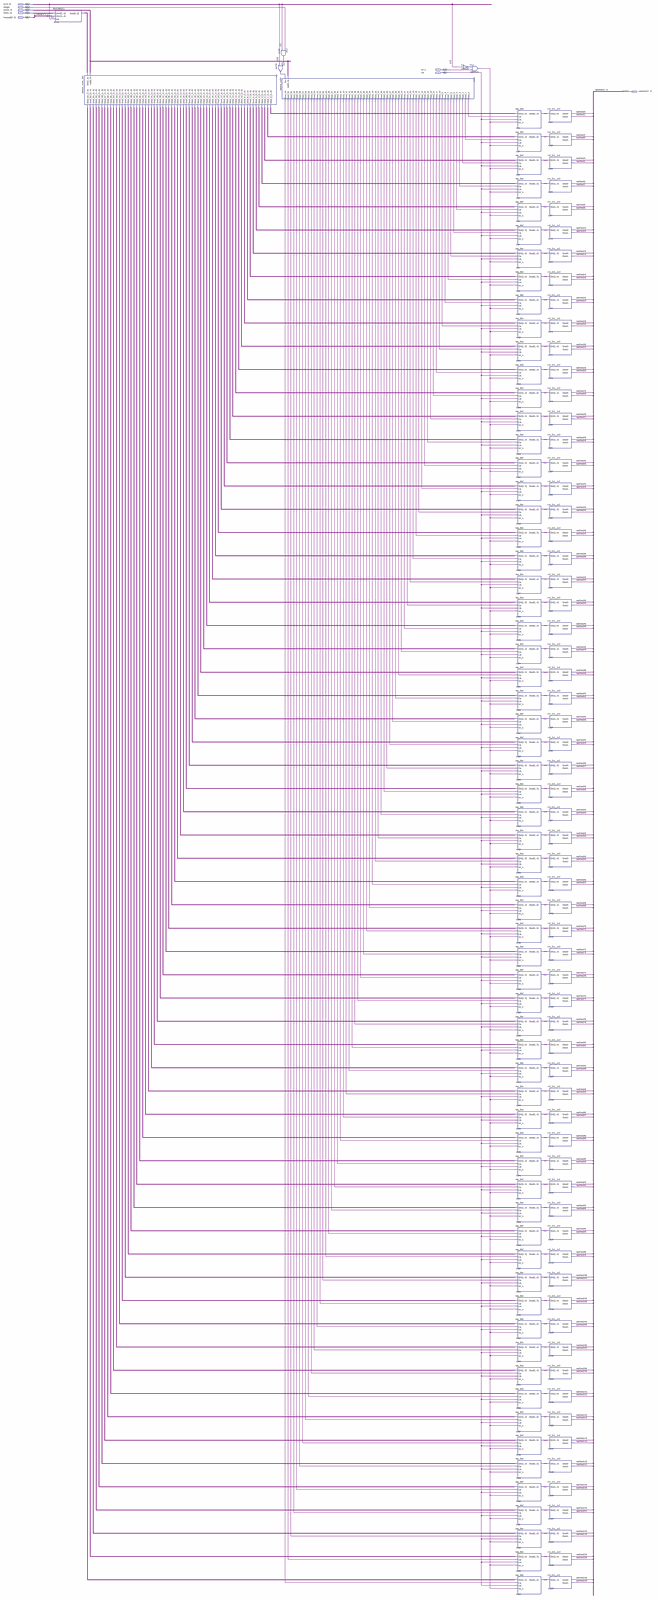
[diagram p0: schematic sheet, whole]
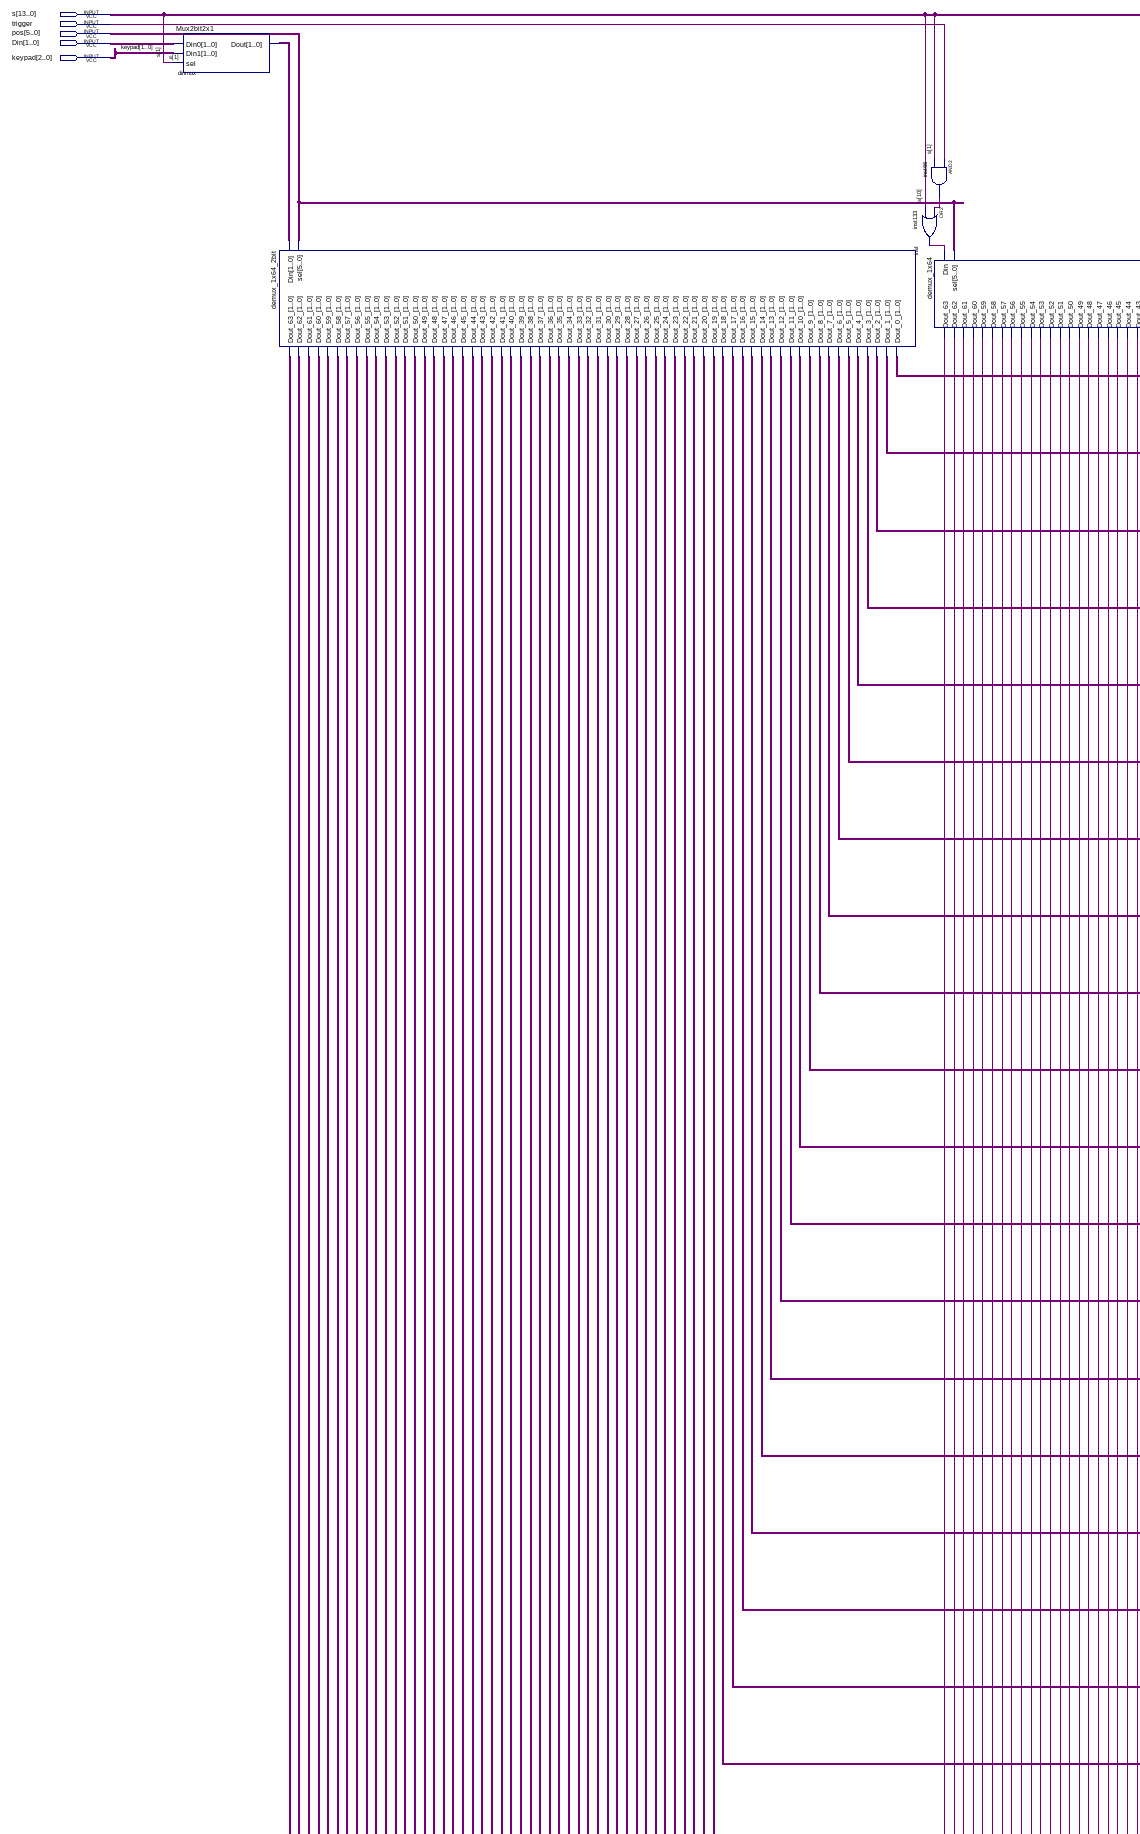
[diagram p1: schematic sheet, upper left part]
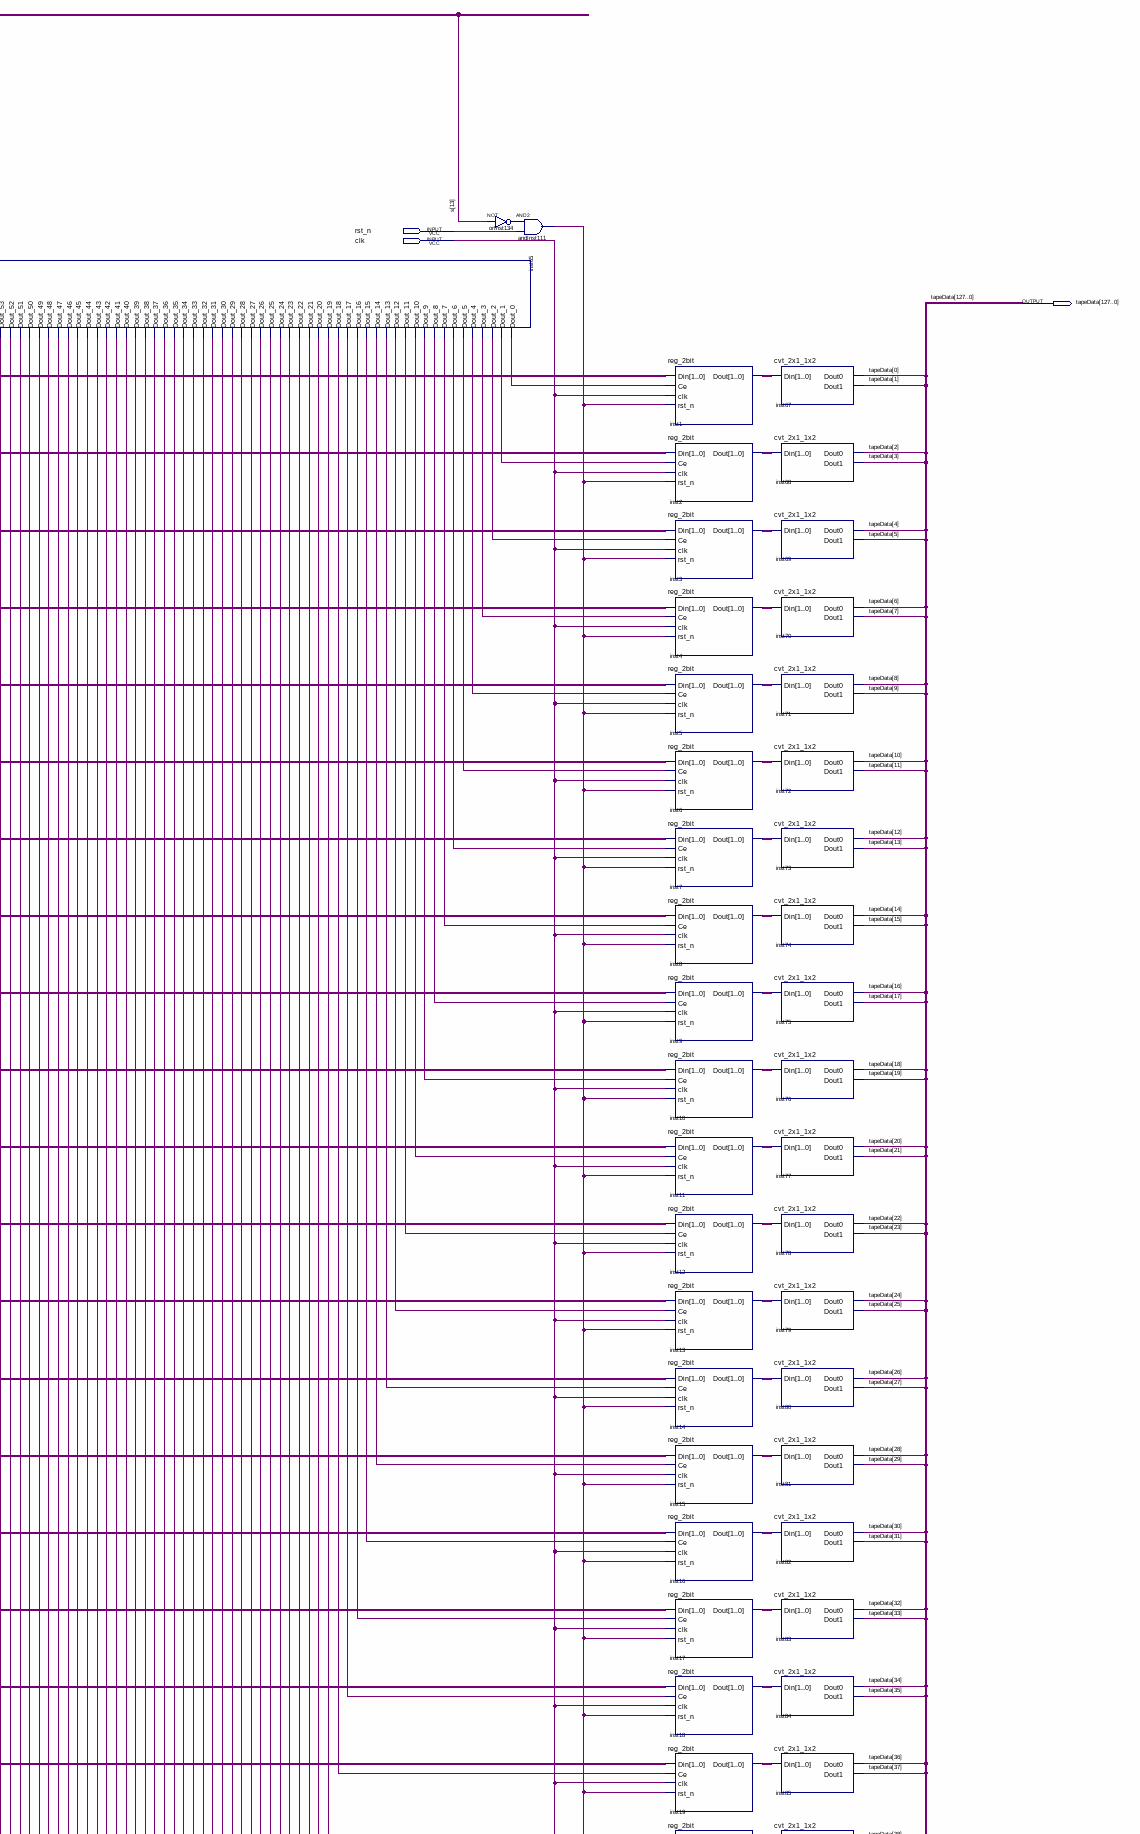
[diagram p2: schematic sheet, upper right part]
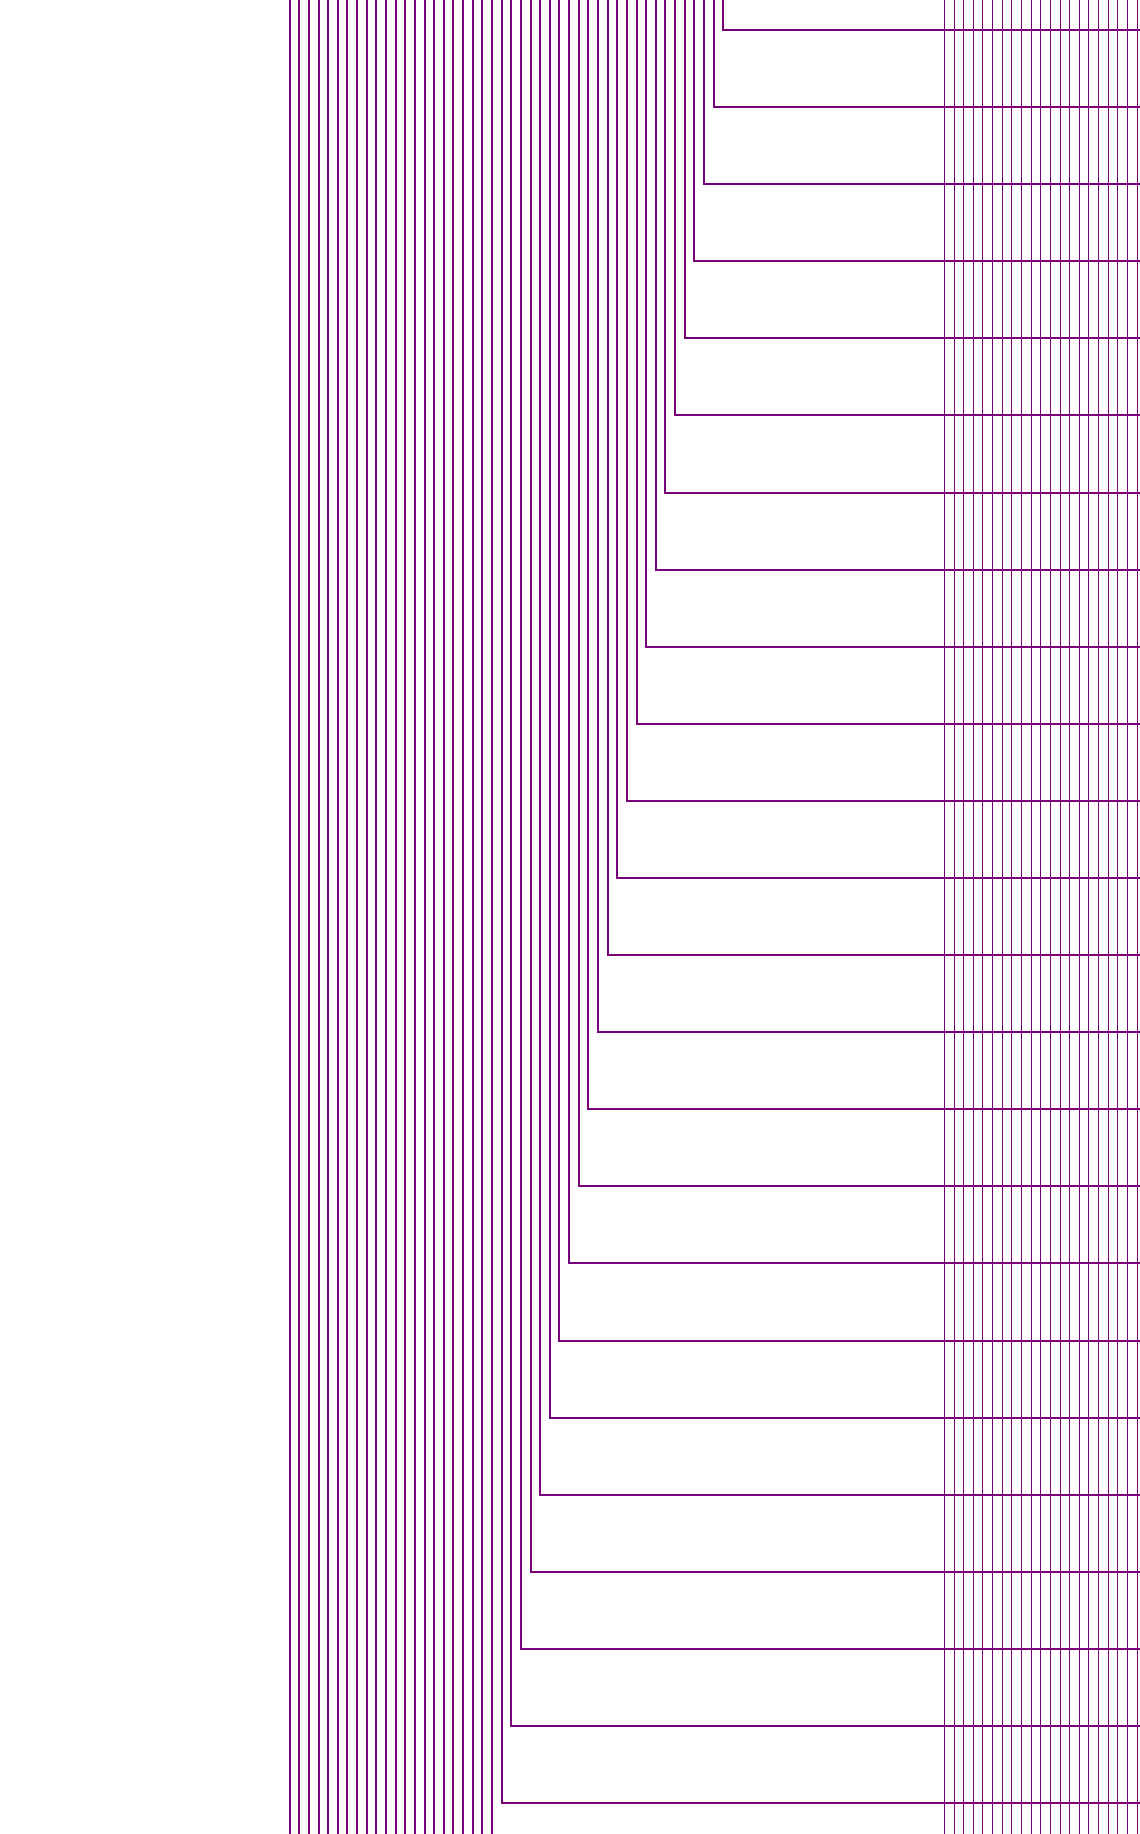
[diagram p3: schematic sheet, middle left part]
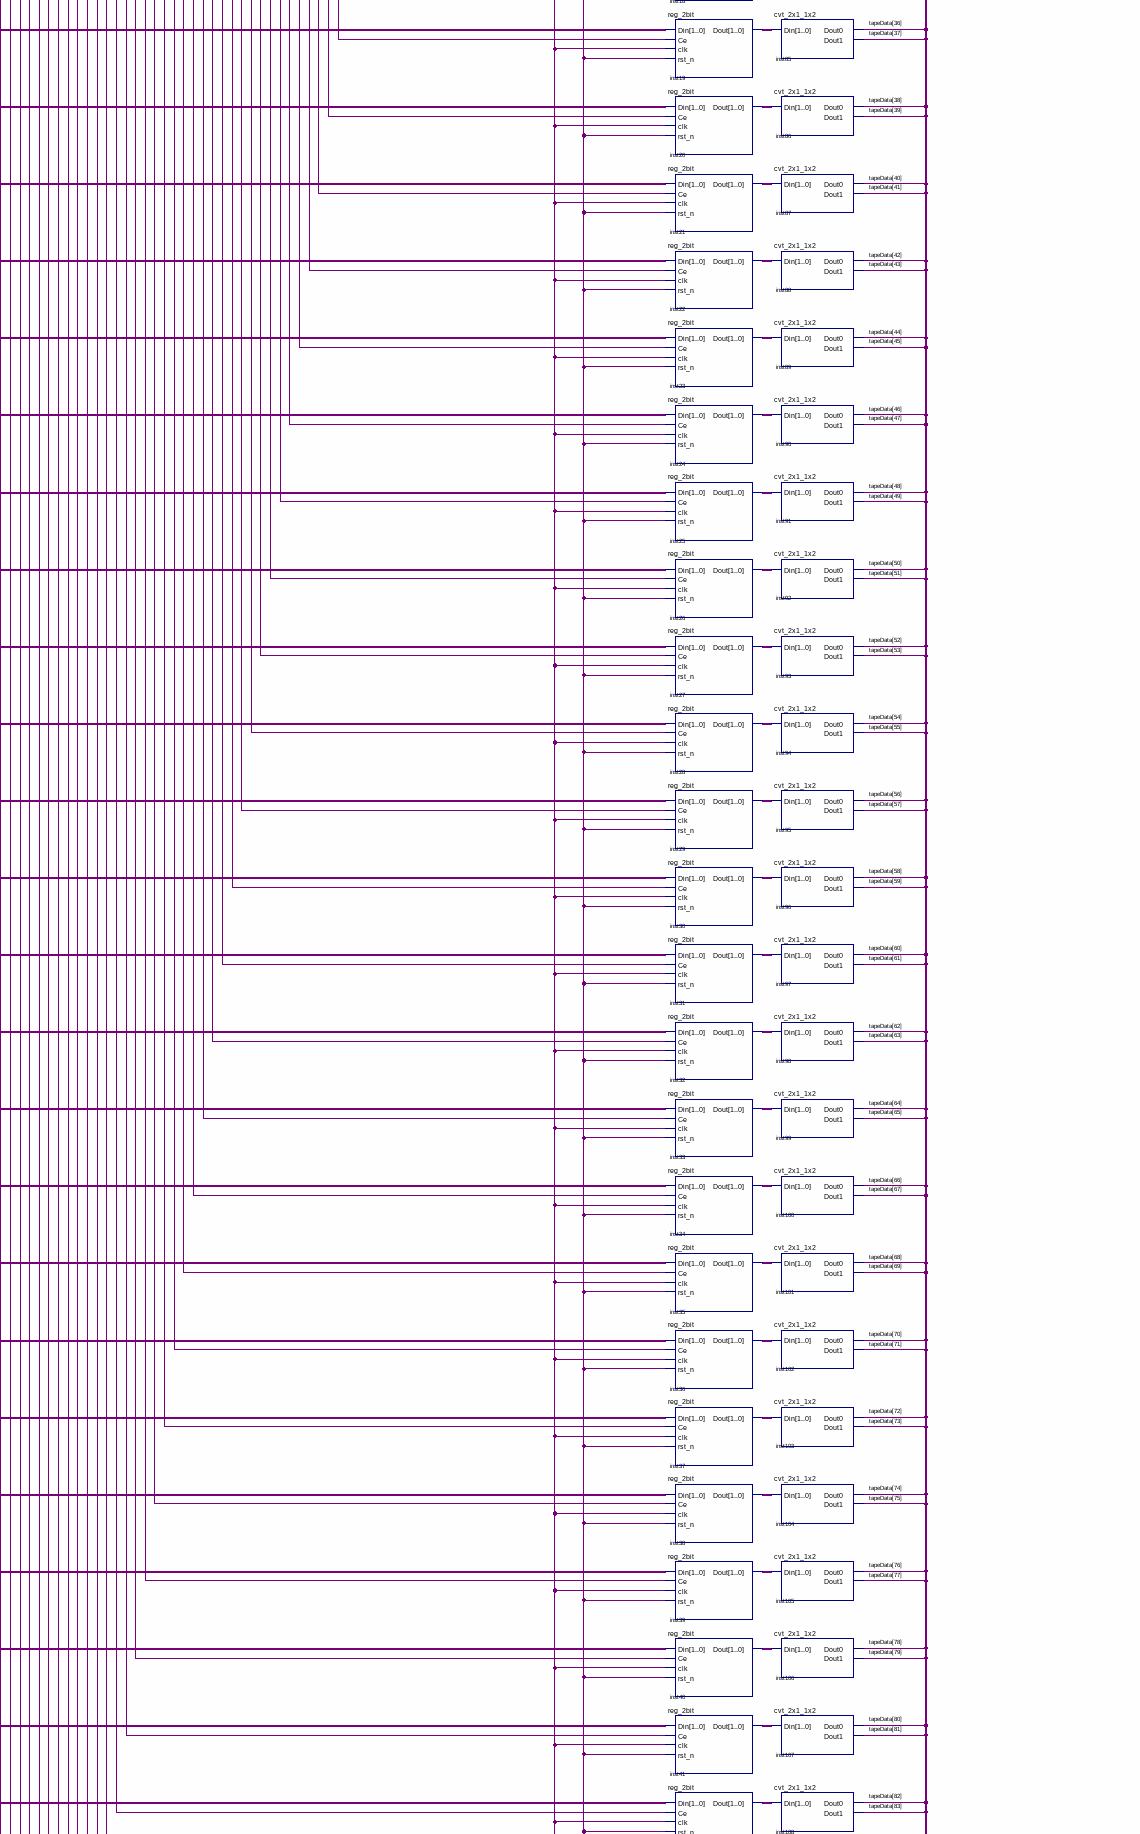
[diagram p4: schematic sheet, middle right part]
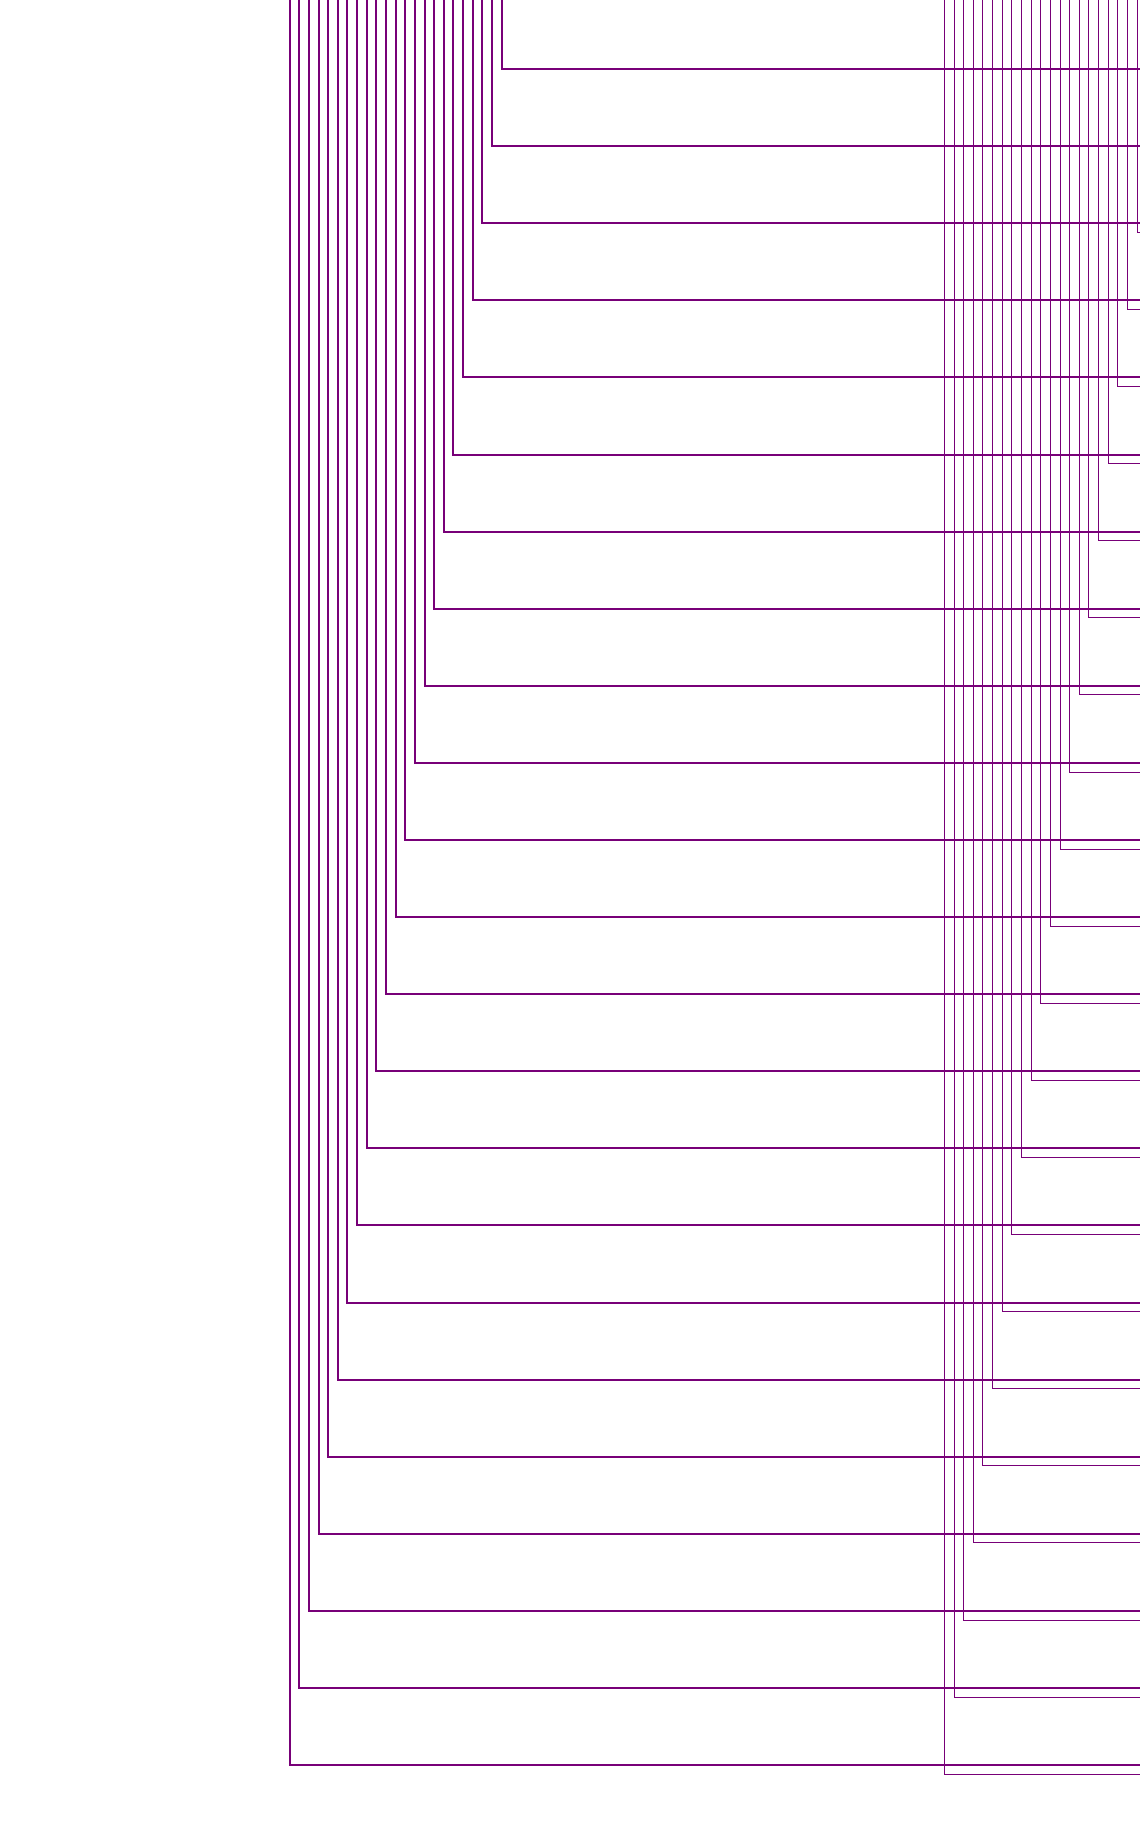
[diagram p5: schematic sheet, lower left part]
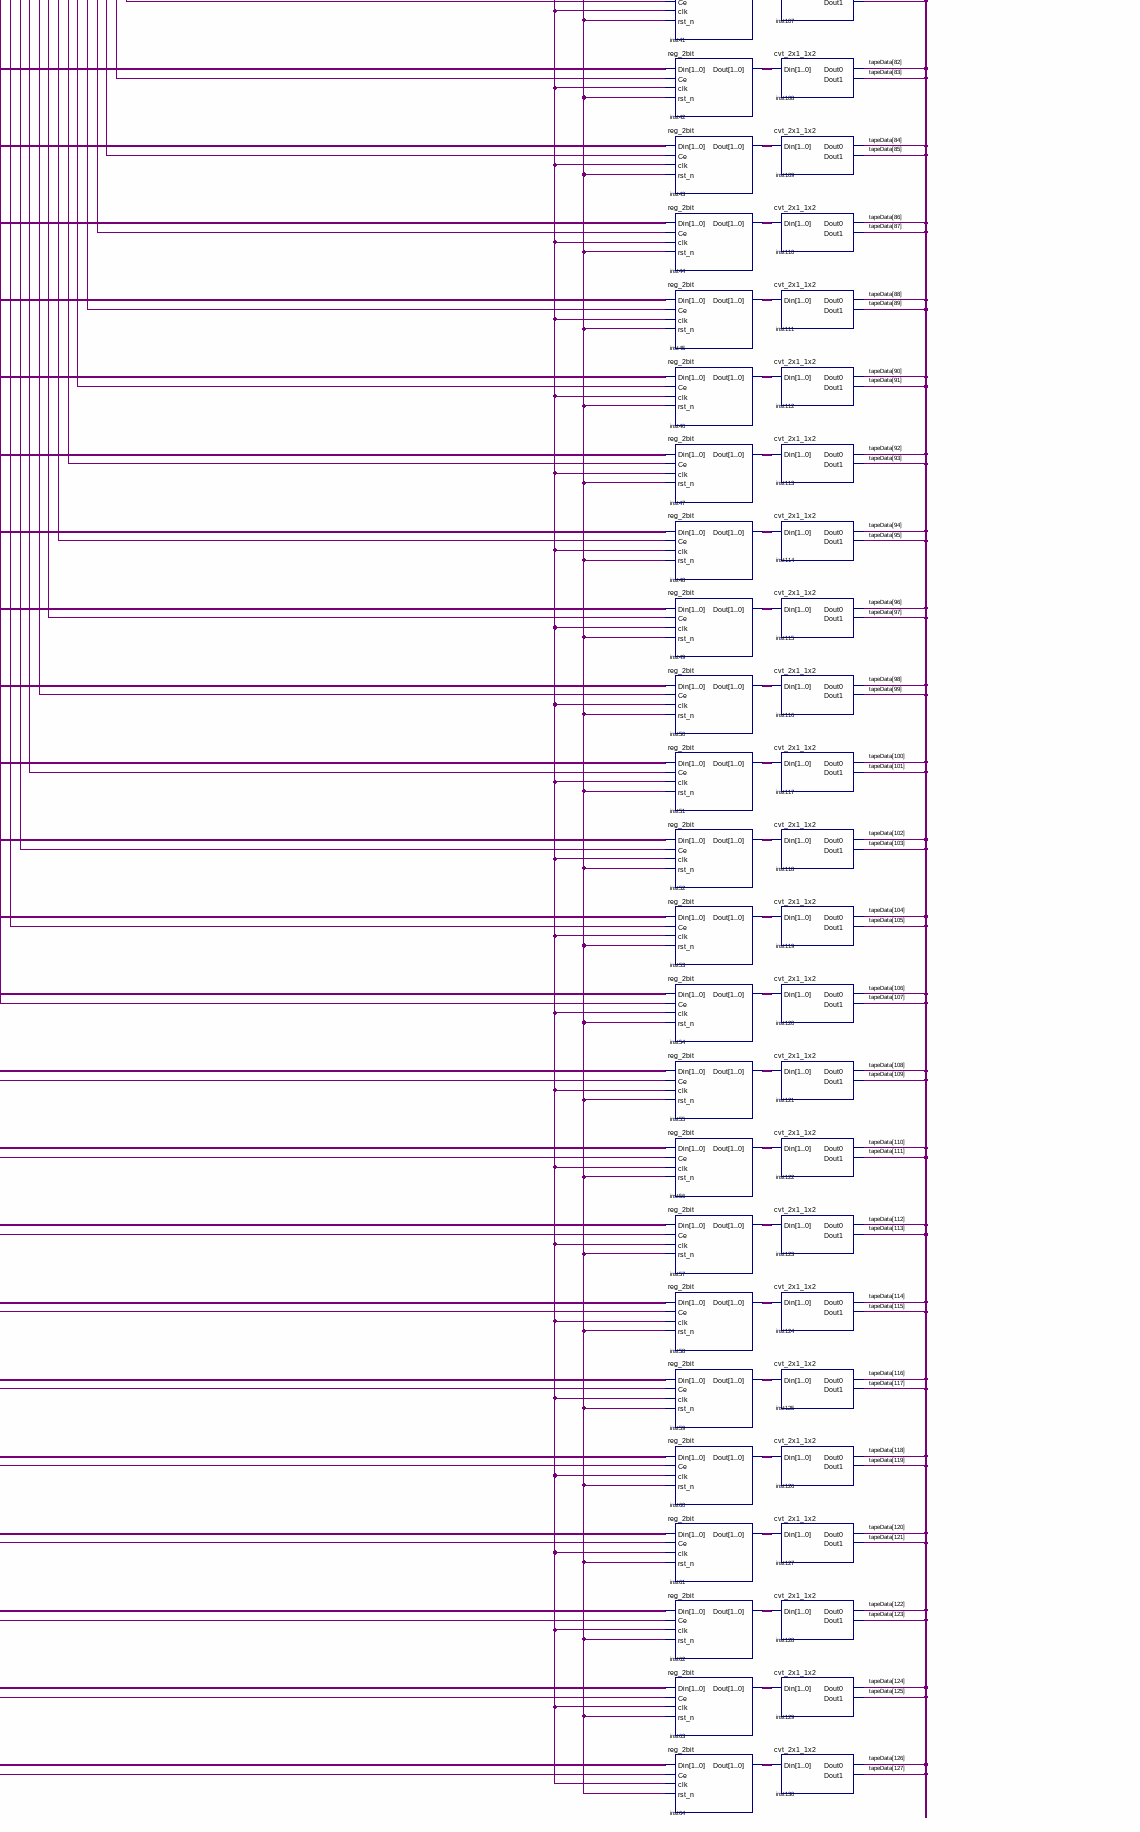
[diagram p6: schematic sheet, lower right part]
// Quartus schematic tape_64.bdf as structural Verilog: 135 symbols, 8 pins
module tape_64 (
  input  [13:0] s,
  input  trigger,
  input  [5:0] pos,
  input  [1:0] Din,
  input  [2:0] keypad,
  input  rst_n,
  input  clk,
  output [127:0] tapeData
);

  wire andInst111_out, inst65_dout_0, inst65_dout_1, inst65_dout_2, inst65_dout_3, inst65_dout_4,
       inst65_dout_5, inst65_dout_6, inst65_dout_7, inst65_dout_8, inst65_dout_9, inst65_dout_10,
       inst65_dout_11, inst65_dout_12, inst65_dout_13, inst65_dout_14, inst65_dout_15, inst65_dout_16,
       inst65_dout_17, inst65_dout_18, inst65_dout_19, inst65_dout_20, inst65_dout_21, inst65_dout_22,
       inst65_dout_23, inst65_dout_24, inst65_dout_25, inst65_dout_26, inst65_dout_27, inst65_dout_28,
       inst65_dout_29, inst65_dout_30, inst65_dout_31, inst65_dout_32, inst65_dout_33, inst65_dout_34,
       inst65_dout_35, inst65_dout_36, inst65_dout_37, inst65_dout_38, inst65_dout_39, inst65_dout_40,
       inst65_dout_41, inst65_dout_42, inst65_dout_43, inst65_dout_44, inst65_dout_45, inst65_dout_46,
       inst65_dout_47, inst65_dout_48, inst65_dout_49, inst65_dout_50, inst65_dout_51, inst65_dout_52,
       inst65_dout_53, inst65_dout_54, inst65_dout_55, inst65_dout_56, inst65_dout_57, inst65_dout_58,
       inst65_dout_59, inst65_dout_60, inst65_dout_61, inst65_dout_62, inst65_dout_63, inst66_out,
       inst133_out, orInst134_out;
  wire [1:0] dinmux_dout, inst1_dout, inst2_dout, inst3_dout, inst4_dout, inst5_dout, inst6_dout, inst7_dout,
       inst8_dout, inst9_dout, inst10_dout, inst11_dout, inst12_dout, inst13_dout, inst14_dout, inst15_dout,
       inst16_dout, inst17_dout, inst18_dout, inst19_dout, inst20_dout, inst21_dout, inst22_dout,
       inst23_dout, inst24_dout, inst25_dout, inst26_dout, inst27_dout, inst28_dout, inst29_dout,
       inst30_dout, inst31_dout, inst32_dout, inst33_dout, inst34_dout, inst35_dout, inst36_dout,
       inst37_dout, inst38_dout, inst39_dout, inst40_dout, inst41_dout, inst42_dout, inst43_dout,
       inst44_dout, inst45_dout, inst46_dout, inst47_dout, inst48_dout, inst49_dout, inst50_dout,
       inst51_dout, inst52_dout, inst53_dout, inst54_dout, inst55_dout, inst56_dout, inst57_dout,
       inst58_dout, inst59_dout, inst60_dout, inst61_dout, inst62_dout, inst63_dout, inst64_dout,
       inst_dout_0_, inst_dout_1_, inst_dout_2_, inst_dout_3_, inst_dout_4_, inst_dout_5_, inst_dout_6_,
       inst_dout_7_, inst_dout_8_, inst_dout_9_, inst_dout_10_, inst_dout_11_, inst_dout_12_, inst_dout_13_,
       inst_dout_14_, inst_dout_15_, inst_dout_16_, inst_dout_17_, inst_dout_18_, inst_dout_19_,
       inst_dout_20_, inst_dout_21_, inst_dout_22_, inst_dout_23_, inst_dout_24_, inst_dout_25_,
       inst_dout_26_, inst_dout_27_, inst_dout_28_, inst_dout_29_, inst_dout_30_, inst_dout_31_,
       inst_dout_32_, inst_dout_33_, inst_dout_34_, inst_dout_35_, inst_dout_36_, inst_dout_37_,
       inst_dout_38_, inst_dout_39_, inst_dout_40_, inst_dout_41_, inst_dout_42_, inst_dout_43_,
       inst_dout_44_, inst_dout_45_, inst_dout_46_, inst_dout_47_, inst_dout_48_, inst_dout_49_,
       inst_dout_50_, inst_dout_51_, inst_dout_52_, inst_dout_53_, inst_dout_54_, inst_dout_55_,
       inst_dout_56_, inst_dout_57_, inst_dout_58_, inst_dout_59_, inst_dout_60_, inst_dout_61_,
       inst_dout_62_, inst_dout_63_;

  Mux2bit2x1 dinmux (.Din0(Din), .Din1(keypad[1:0]), .sel(s[1]), .Dout(dinmux_dout));
  demux_1x64_2bit inst (
    .Din(dinmux_dout), .sel(pos), .Dout_63_(inst_dout_63_), .Dout_62_(inst_dout_62_),
    .Dout_61_(inst_dout_61_), .Dout_60_(inst_dout_60_), .Dout_59_(inst_dout_59_), .Dout_58_(inst_dout_58_),
    .Dout_57_(inst_dout_57_), .Dout_56_(inst_dout_56_), .Dout_55_(inst_dout_55_), .Dout_54_(inst_dout_54_),
    .Dout_53_(inst_dout_53_), .Dout_52_(inst_dout_52_), .Dout_51_(inst_dout_51_), .Dout_50_(inst_dout_50_),
    .Dout_49_(inst_dout_49_), .Dout_48_(inst_dout_48_), .Dout_47_(inst_dout_47_), .Dout_46_(inst_dout_46_),
    .Dout_45_(inst_dout_45_), .Dout_44_(inst_dout_44_), .Dout_43_(inst_dout_43_), .Dout_42_(inst_dout_42_),
    .Dout_41_(inst_dout_41_), .Dout_40_(inst_dout_40_), .Dout_39_(inst_dout_39_), .Dout_38_(inst_dout_38_),
    .Dout_37_(inst_dout_37_), .Dout_36_(inst_dout_36_), .Dout_35_(inst_dout_35_), .Dout_34_(inst_dout_34_),
    .Dout_33_(inst_dout_33_), .Dout_32_(inst_dout_32_), .Dout_31_(inst_dout_31_), .Dout_30_(inst_dout_30_),
    .Dout_29_(inst_dout_29_), .Dout_28_(inst_dout_28_), .Dout_27_(inst_dout_27_), .Dout_26_(inst_dout_26_),
    .Dout_25_(inst_dout_25_), .Dout_24_(inst_dout_24_), .Dout_23_(inst_dout_23_), .Dout_22_(inst_dout_22_),
    .Dout_21_(inst_dout_21_), .Dout_20_(inst_dout_20_), .Dout_19_(inst_dout_19_), .Dout_18_(inst_dout_18_),
    .Dout_17_(inst_dout_17_), .Dout_16_(inst_dout_16_), .Dout_15_(inst_dout_15_), .Dout_14_(inst_dout_14_),
    .Dout_13_(inst_dout_13_), .Dout_12_(inst_dout_12_), .Dout_11_(inst_dout_11_), .Dout_10_(inst_dout_10_),
    .Dout_9_(inst_dout_9_), .Dout_8_(inst_dout_8_), .Dout_7_(inst_dout_7_), .Dout_6_(inst_dout_6_),
    .Dout_5_(inst_dout_5_), .Dout_4_(inst_dout_4_), .Dout_3_(inst_dout_3_), .Dout_2_(inst_dout_2_),
    .Dout_1_(inst_dout_1_), .Dout_0_(inst_dout_0_));
  and inst66 (inst66_out, trigger, s[1]);
  or inst133 (inst133_out, inst66_out, s[10]);
  demux_1x64 inst65 (
    .Din(inst133_out), .sel(pos), .Dout_63(inst65_dout_63), .Dout_62(inst65_dout_62),
    .Dout_61(inst65_dout_61), .Dout_60(inst65_dout_60), .Dout_59(inst65_dout_59), .Dout_58(inst65_dout_58),
    .Dout_57(inst65_dout_57), .Dout_56(inst65_dout_56), .Dout_55(inst65_dout_55), .Dout_54(inst65_dout_54),
    .Dout_53(inst65_dout_53), .Dout_52(inst65_dout_52), .Dout_51(inst65_dout_51), .Dout_50(inst65_dout_50),
    .Dout_49(inst65_dout_49), .Dout_48(inst65_dout_48), .Dout_47(inst65_dout_47), .Dout_46(inst65_dout_46),
    .Dout_45(inst65_dout_45), .Dout_44(inst65_dout_44), .Dout_43(inst65_dout_43), .Dout_42(inst65_dout_42),
    .Dout_41(inst65_dout_41), .Dout_40(inst65_dout_40), .Dout_39(inst65_dout_39), .Dout_38(inst65_dout_38),
    .Dout_37(inst65_dout_37), .Dout_36(inst65_dout_36), .Dout_35(inst65_dout_35), .Dout_34(inst65_dout_34),
    .Dout_33(inst65_dout_33), .Dout_32(inst65_dout_32), .Dout_31(inst65_dout_31), .Dout_30(inst65_dout_30),
    .Dout_29(inst65_dout_29), .Dout_28(inst65_dout_28), .Dout_27(inst65_dout_27), .Dout_26(inst65_dout_26),
    .Dout_25(inst65_dout_25), .Dout_24(inst65_dout_24), .Dout_23(inst65_dout_23), .Dout_22(inst65_dout_22),
    .Dout_21(inst65_dout_21), .Dout_20(inst65_dout_20), .Dout_19(inst65_dout_19), .Dout_18(inst65_dout_18),
    .Dout_17(inst65_dout_17), .Dout_16(inst65_dout_16), .Dout_15(inst65_dout_15), .Dout_14(inst65_dout_14),
    .Dout_13(inst65_dout_13), .Dout_12(inst65_dout_12), .Dout_11(inst65_dout_11), .Dout_10(inst65_dout_10),
    .Dout_9(inst65_dout_9), .Dout_8(inst65_dout_8), .Dout_7(inst65_dout_7), .Dout_6(inst65_dout_6),
    .Dout_5(inst65_dout_5), .Dout_4(inst65_dout_4), .Dout_3(inst65_dout_3), .Dout_2(inst65_dout_2),
    .Dout_1(inst65_dout_1), .Dout_0(inst65_dout_0));
  not orInst134 (orInst134_out, s[13]);
  and andInst111 (andInst111_out, orInst134_out, rst_n);
  reg_2bit inst1 (.Din(inst_dout_0_), .Ce(inst65_dout_0), .clk(clk), .rst_n(andInst111_out), .Dout(inst1_dout));
  reg_2bit inst2 (.Din(inst_dout_1_), .Ce(inst65_dout_1), .clk(clk), .rst_n(andInst111_out), .Dout(inst2_dout));
  reg_2bit inst3 (.Din(inst_dout_2_), .Ce(inst65_dout_2), .clk(clk), .rst_n(andInst111_out), .Dout(inst3_dout));
  reg_2bit inst4 (.Din(inst_dout_3_), .Ce(inst65_dout_3), .clk(clk), .rst_n(andInst111_out), .Dout(inst4_dout));
  reg_2bit inst5 (.Din(inst_dout_4_), .Ce(inst65_dout_4), .clk(clk), .rst_n(andInst111_out), .Dout(inst5_dout));
  reg_2bit inst6 (.Din(inst_dout_5_), .Ce(inst65_dout_5), .clk(clk), .rst_n(andInst111_out), .Dout(inst6_dout));
  reg_2bit inst7 (.Din(inst_dout_6_), .Ce(inst65_dout_6), .clk(clk), .rst_n(andInst111_out), .Dout(inst7_dout));
  reg_2bit inst8 (.Din(inst_dout_7_), .Ce(inst65_dout_7), .clk(clk), .rst_n(andInst111_out), .Dout(inst8_dout));
  reg_2bit inst9 (.Din(inst_dout_8_), .Ce(inst65_dout_8), .clk(clk), .rst_n(andInst111_out), .Dout(inst9_dout));
  reg_2bit inst10 (.Din(inst_dout_9_), .Ce(inst65_dout_9), .clk(clk), .rst_n(andInst111_out), .Dout(inst10_dout));
  reg_2bit inst11 (.Din(inst_dout_10_), .Ce(inst65_dout_10), .clk(clk), .rst_n(andInst111_out), .Dout(inst11_dout));
  reg_2bit inst12 (.Din(inst_dout_11_), .Ce(inst65_dout_11), .clk(clk), .rst_n(andInst111_out), .Dout(inst12_dout));
  reg_2bit inst13 (.Din(inst_dout_12_), .Ce(inst65_dout_12), .clk(clk), .rst_n(andInst111_out), .Dout(inst13_dout));
  reg_2bit inst14 (.Din(inst_dout_13_), .Ce(inst65_dout_13), .clk(clk), .rst_n(andInst111_out), .Dout(inst14_dout));
  reg_2bit inst15 (.Din(inst_dout_14_), .Ce(inst65_dout_14), .clk(clk), .rst_n(andInst111_out), .Dout(inst15_dout));
  reg_2bit inst16 (.Din(inst_dout_15_), .Ce(inst65_dout_15), .clk(clk), .rst_n(andInst111_out), .Dout(inst16_dout));
  reg_2bit inst17 (.Din(inst_dout_16_), .Ce(inst65_dout_16), .clk(clk), .rst_n(andInst111_out), .Dout(inst17_dout));
  reg_2bit inst18 (.Din(inst_dout_17_), .Ce(inst65_dout_17), .clk(clk), .rst_n(andInst111_out), .Dout(inst18_dout));
  reg_2bit inst19 (.Din(inst_dout_18_), .Ce(inst65_dout_18), .clk(clk), .rst_n(andInst111_out), .Dout(inst19_dout));
  reg_2bit inst20 (.Din(inst_dout_19_), .Ce(inst65_dout_19), .clk(clk), .rst_n(andInst111_out), .Dout(inst20_dout));
  reg_2bit inst21 (.Din(inst_dout_20_), .Ce(inst65_dout_20), .clk(clk), .rst_n(andInst111_out), .Dout(inst21_dout));
  reg_2bit inst22 (.Din(inst_dout_21_), .Ce(inst65_dout_21), .clk(clk), .rst_n(andInst111_out), .Dout(inst22_dout));
  reg_2bit inst23 (.Din(inst_dout_22_), .Ce(inst65_dout_22), .clk(clk), .rst_n(andInst111_out), .Dout(inst23_dout));
  reg_2bit inst24 (.Din(inst_dout_23_), .Ce(inst65_dout_23), .clk(clk), .rst_n(andInst111_out), .Dout(inst24_dout));
  reg_2bit inst25 (.Din(inst_dout_24_), .Ce(inst65_dout_24), .clk(clk), .rst_n(andInst111_out), .Dout(inst25_dout));
  reg_2bit inst26 (.Din(inst_dout_25_), .Ce(inst65_dout_25), .clk(clk), .rst_n(andInst111_out), .Dout(inst26_dout));
  reg_2bit inst27 (.Din(inst_dout_26_), .Ce(inst65_dout_26), .clk(clk), .rst_n(andInst111_out), .Dout(inst27_dout));
  reg_2bit inst28 (.Din(inst_dout_27_), .Ce(inst65_dout_27), .clk(clk), .rst_n(andInst111_out), .Dout(inst28_dout));
  reg_2bit inst29 (.Din(inst_dout_28_), .Ce(inst65_dout_28), .clk(clk), .rst_n(andInst111_out), .Dout(inst29_dout));
  reg_2bit inst30 (.Din(inst_dout_29_), .Ce(inst65_dout_29), .clk(clk), .rst_n(andInst111_out), .Dout(inst30_dout));
  reg_2bit inst31 (.Din(inst_dout_30_), .Ce(inst65_dout_30), .clk(clk), .rst_n(andInst111_out), .Dout(inst31_dout));
  reg_2bit inst32 (.Din(inst_dout_31_), .Ce(inst65_dout_31), .clk(clk), .rst_n(andInst111_out), .Dout(inst32_dout));
  reg_2bit inst33 (.Din(inst_dout_32_), .Ce(inst65_dout_32), .clk(clk), .rst_n(andInst111_out), .Dout(inst33_dout));
  reg_2bit inst34 (.Din(inst_dout_33_), .Ce(inst65_dout_33), .clk(clk), .rst_n(andInst111_out), .Dout(inst34_dout));
  reg_2bit inst35 (.Din(inst_dout_34_), .Ce(inst65_dout_34), .clk(clk), .rst_n(andInst111_out), .Dout(inst35_dout));
  reg_2bit inst36 (.Din(inst_dout_35_), .Ce(inst65_dout_35), .clk(clk), .rst_n(andInst111_out), .Dout(inst36_dout));
  reg_2bit inst37 (.Din(inst_dout_36_), .Ce(inst65_dout_36), .clk(clk), .rst_n(andInst111_out), .Dout(inst37_dout));
  reg_2bit inst38 (.Din(inst_dout_37_), .Ce(inst65_dout_37), .clk(clk), .rst_n(andInst111_out), .Dout(inst38_dout));
  reg_2bit inst39 (.Din(inst_dout_38_), .Ce(inst65_dout_38), .clk(clk), .rst_n(andInst111_out), .Dout(inst39_dout));
  reg_2bit inst40 (.Din(inst_dout_39_), .Ce(inst65_dout_39), .clk(clk), .rst_n(andInst111_out), .Dout(inst40_dout));
  reg_2bit inst41 (.Din(inst_dout_40_), .Ce(inst65_dout_40), .clk(clk), .rst_n(andInst111_out), .Dout(inst41_dout));
  reg_2bit inst42 (.Din(inst_dout_41_), .Ce(inst65_dout_41), .clk(clk), .rst_n(andInst111_out), .Dout(inst42_dout));
  reg_2bit inst43 (.Din(inst_dout_42_), .Ce(inst65_dout_42), .clk(clk), .rst_n(andInst111_out), .Dout(inst43_dout));
  reg_2bit inst44 (.Din(inst_dout_43_), .Ce(inst65_dout_43), .clk(clk), .rst_n(andInst111_out), .Dout(inst44_dout));
  reg_2bit inst45 (.Din(inst_dout_44_), .Ce(inst65_dout_44), .clk(clk), .rst_n(andInst111_out), .Dout(inst45_dout));
  reg_2bit inst46 (.Din(inst_dout_45_), .Ce(inst65_dout_45), .clk(clk), .rst_n(andInst111_out), .Dout(inst46_dout));
  reg_2bit inst47 (.Din(inst_dout_46_), .Ce(inst65_dout_46), .clk(clk), .rst_n(andInst111_out), .Dout(inst47_dout));
  reg_2bit inst48 (.Din(inst_dout_47_), .Ce(inst65_dout_47), .clk(clk), .rst_n(andInst111_out), .Dout(inst48_dout));
  reg_2bit inst49 (.Din(inst_dout_48_), .Ce(inst65_dout_48), .clk(clk), .rst_n(andInst111_out), .Dout(inst49_dout));
  reg_2bit inst50 (.Din(inst_dout_49_), .Ce(inst65_dout_49), .clk(clk), .rst_n(andInst111_out), .Dout(inst50_dout));
  reg_2bit inst51 (.Din(inst_dout_50_), .Ce(inst65_dout_50), .clk(clk), .rst_n(andInst111_out), .Dout(inst51_dout));
  reg_2bit inst52 (.Din(inst_dout_51_), .Ce(inst65_dout_51), .clk(clk), .rst_n(andInst111_out), .Dout(inst52_dout));
  reg_2bit inst53 (.Din(inst_dout_52_), .Ce(inst65_dout_52), .clk(clk), .rst_n(andInst111_out), .Dout(inst53_dout));
  reg_2bit inst54 (.Din(inst_dout_53_), .Ce(inst65_dout_53), .clk(clk), .rst_n(andInst111_out), .Dout(inst54_dout));
  reg_2bit inst55 (.Din(inst_dout_54_), .Ce(inst65_dout_54), .clk(clk), .rst_n(andInst111_out), .Dout(inst55_dout));
  reg_2bit inst56 (.Din(inst_dout_55_), .Ce(inst65_dout_55), .clk(clk), .rst_n(andInst111_out), .Dout(inst56_dout));
  reg_2bit inst57 (.Din(inst_dout_56_), .Ce(inst65_dout_56), .clk(clk), .rst_n(andInst111_out), .Dout(inst57_dout));
  reg_2bit inst58 (.Din(inst_dout_57_), .Ce(inst65_dout_57), .clk(clk), .rst_n(andInst111_out), .Dout(inst58_dout));
  reg_2bit inst59 (.Din(inst_dout_58_), .Ce(inst65_dout_58), .clk(clk), .rst_n(andInst111_out), .Dout(inst59_dout));
  reg_2bit inst60 (.Din(inst_dout_59_), .Ce(inst65_dout_59), .clk(clk), .rst_n(andInst111_out), .Dout(inst60_dout));
  reg_2bit inst61 (.Din(inst_dout_60_), .Ce(inst65_dout_60), .clk(clk), .rst_n(andInst111_out), .Dout(inst61_dout));
  reg_2bit inst62 (.Din(inst_dout_61_), .Ce(inst65_dout_61), .clk(clk), .rst_n(andInst111_out), .Dout(inst62_dout));
  reg_2bit inst63 (.Din(inst_dout_62_), .Ce(inst65_dout_62), .clk(clk), .rst_n(andInst111_out), .Dout(inst63_dout));
  reg_2bit inst64 (.Din(inst_dout_63_), .Ce(inst65_dout_63), .clk(clk), .rst_n(andInst111_out), .Dout(inst64_dout));
  cvt_2x1_1x2 inst67 (.Din(inst1_dout), .Dout0(tapeData[0]), .Dout1(tapeData[1]));
  cvt_2x1_1x2 inst68 (.Din(inst2_dout), .Dout0(tapeData[2]), .Dout1(tapeData[3]));
  cvt_2x1_1x2 inst69 (.Din(inst3_dout), .Dout0(tapeData[4]), .Dout1(tapeData[5]));
  cvt_2x1_1x2 inst70 (.Din(inst4_dout), .Dout0(tapeData[6]), .Dout1(tapeData[7]));
  cvt_2x1_1x2 inst71 (.Din(inst5_dout), .Dout0(tapeData[8]), .Dout1(tapeData[9]));
  cvt_2x1_1x2 inst72 (.Din(inst6_dout), .Dout0(tapeData[10]), .Dout1(tapeData[11]));
  cvt_2x1_1x2 inst73 (.Din(inst7_dout), .Dout0(tapeData[12]), .Dout1(tapeData[13]));
  cvt_2x1_1x2 inst74 (.Din(inst8_dout), .Dout0(tapeData[14]), .Dout1(tapeData[15]));
  cvt_2x1_1x2 inst75 (.Din(inst9_dout), .Dout0(tapeData[16]), .Dout1(tapeData[17]));
  cvt_2x1_1x2 inst76 (.Din(inst10_dout), .Dout0(tapeData[18]), .Dout1(tapeData[19]));
  cvt_2x1_1x2 inst77 (.Din(inst11_dout), .Dout0(tapeData[20]), .Dout1(tapeData[21]));
  cvt_2x1_1x2 inst78 (.Din(inst12_dout), .Dout0(tapeData[22]), .Dout1(tapeData[23]));
  cvt_2x1_1x2 inst79 (.Din(inst13_dout), .Dout0(tapeData[24]), .Dout1(tapeData[25]));
  cvt_2x1_1x2 inst80 (.Din(inst14_dout), .Dout0(tapeData[26]), .Dout1(tapeData[27]));
  cvt_2x1_1x2 inst81 (.Din(inst15_dout), .Dout0(tapeData[28]), .Dout1(tapeData[29]));
  cvt_2x1_1x2 inst82 (.Din(inst16_dout), .Dout0(tapeData[30]), .Dout1(tapeData[31]));
  cvt_2x1_1x2 inst83 (.Din(inst17_dout), .Dout0(tapeData[32]), .Dout1(tapeData[33]));
  cvt_2x1_1x2 inst84 (.Din(inst18_dout), .Dout0(tapeData[34]), .Dout1(tapeData[35]));
  cvt_2x1_1x2 inst85 (.Din(inst19_dout), .Dout0(tapeData[36]), .Dout1(tapeData[37]));
  cvt_2x1_1x2 inst86 (.Din(inst20_dout), .Dout0(tapeData[38]), .Dout1(tapeData[39]));
  cvt_2x1_1x2 inst87 (.Din(inst21_dout), .Dout0(tapeData[40]), .Dout1(tapeData[41]));
  cvt_2x1_1x2 inst88 (.Din(inst22_dout), .Dout0(tapeData[42]), .Dout1(tapeData[43]));
  cvt_2x1_1x2 inst89 (.Din(inst23_dout), .Dout0(tapeData[44]), .Dout1(tapeData[45]));
  cvt_2x1_1x2 inst90 (.Din(inst24_dout), .Dout0(tapeData[46]), .Dout1(tapeData[47]));
  cvt_2x1_1x2 inst91 (.Din(inst25_dout), .Dout0(tapeData[48]), .Dout1(tapeData[49]));
  cvt_2x1_1x2 inst92 (.Din(inst26_dout), .Dout0(tapeData[50]), .Dout1(tapeData[51]));
  cvt_2x1_1x2 inst93 (.Din(inst27_dout), .Dout0(tapeData[52]), .Dout1(tapeData[53]));
  cvt_2x1_1x2 inst94 (.Din(inst28_dout), .Dout0(tapeData[54]), .Dout1(tapeData[55]));
  cvt_2x1_1x2 inst95 (.Din(inst29_dout), .Dout0(tapeData[56]), .Dout1(tapeData[57]));
  cvt_2x1_1x2 inst96 (.Din(inst30_dout), .Dout0(tapeData[58]), .Dout1(tapeData[59]));
  cvt_2x1_1x2 inst97 (.Din(inst31_dout), .Dout0(tapeData[60]), .Dout1(tapeData[61]));
  cvt_2x1_1x2 inst98 (.Din(inst32_dout), .Dout0(tapeData[62]), .Dout1(tapeData[63]));
  cvt_2x1_1x2 inst99 (.Din(inst33_dout), .Dout0(tapeData[64]), .Dout1(tapeData[65]));
  cvt_2x1_1x2 inst100 (.Din(inst34_dout), .Dout0(tapeData[66]), .Dout1(tapeData[67]));
  cvt_2x1_1x2 inst101 (.Din(inst35_dout), .Dout0(tapeData[68]), .Dout1(tapeData[69]));
  cvt_2x1_1x2 inst102 (.Din(inst36_dout), .Dout0(tapeData[70]), .Dout1(tapeData[71]));
  cvt_2x1_1x2 inst103 (.Din(inst37_dout), .Dout0(tapeData[72]), .Dout1(tapeData[73]));
  cvt_2x1_1x2 inst104 (.Din(inst38_dout), .Dout0(tapeData[74]), .Dout1(tapeData[75]));
  cvt_2x1_1x2 inst105 (.Din(inst39_dout), .Dout0(tapeData[76]), .Dout1(tapeData[77]));
  cvt_2x1_1x2 inst106 (.Din(inst40_dout), .Dout0(tapeData[78]), .Dout1(tapeData[79]));
  cvt_2x1_1x2 inst107 (.Din(inst41_dout), .Dout0(tapeData[80]), .Dout1(tapeData[81]));
  cvt_2x1_1x2 inst108 (.Din(inst42_dout), .Dout0(tapeData[82]), .Dout1(tapeData[83]));
  cvt_2x1_1x2 inst109 (.Din(inst43_dout), .Dout0(tapeData[84]), .Dout1(tapeData[85]));
  cvt_2x1_1x2 inst110 (.Din(inst44_dout), .Dout0(tapeData[86]), .Dout1(tapeData[87]));
  cvt_2x1_1x2 inst111 (.Din(inst45_dout), .Dout0(tapeData[88]), .Dout1(tapeData[89]));
  cvt_2x1_1x2 inst112 (.Din(inst46_dout), .Dout0(tapeData[90]), .Dout1(tapeData[91]));
  cvt_2x1_1x2 inst113 (.Din(inst47_dout), .Dout0(tapeData[92]), .Dout1(tapeData[93]));
  cvt_2x1_1x2 inst114 (.Din(inst48_dout), .Dout0(tapeData[94]), .Dout1(tapeData[95]));
  cvt_2x1_1x2 inst115 (.Din(inst49_dout), .Dout0(tapeData[96]), .Dout1(tapeData[97]));
  cvt_2x1_1x2 inst116 (.Din(inst50_dout), .Dout0(tapeData[98]), .Dout1(tapeData[99]));
  cvt_2x1_1x2 inst117 (.Din(inst51_dout), .Dout0(tapeData[100]), .Dout1(tapeData[101]));
  cvt_2x1_1x2 inst118 (.Din(inst52_dout), .Dout0(tapeData[102]), .Dout1(tapeData[103]));
  cvt_2x1_1x2 inst119 (.Din(inst53_dout), .Dout0(tapeData[104]), .Dout1(tapeData[105]));
  cvt_2x1_1x2 inst120 (.Din(inst54_dout), .Dout0(tapeData[106]), .Dout1(tapeData[107]));
  cvt_2x1_1x2 inst121 (.Din(inst55_dout), .Dout0(tapeData[108]), .Dout1(tapeData[109]));
  cvt_2x1_1x2 inst122 (.Din(inst56_dout), .Dout0(tapeData[110]), .Dout1(tapeData[111]));
  cvt_2x1_1x2 inst123 (.Din(inst57_dout), .Dout0(tapeData[112]), .Dout1(tapeData[113]));
  cvt_2x1_1x2 inst124 (.Din(inst58_dout), .Dout0(tapeData[114]), .Dout1(tapeData[115]));
  cvt_2x1_1x2 inst125 (.Din(inst59_dout), .Dout0(tapeData[116]), .Dout1(tapeData[117]));
  cvt_2x1_1x2 inst126 (.Din(inst60_dout), .Dout0(tapeData[118]), .Dout1(tapeData[119]));
  cvt_2x1_1x2 inst127 (.Din(inst61_dout), .Dout0(tapeData[120]), .Dout1(tapeData[121]));
  cvt_2x1_1x2 inst128 (.Din(inst62_dout), .Dout0(tapeData[122]), .Dout1(tapeData[123]));
  cvt_2x1_1x2 inst129 (.Din(inst63_dout), .Dout0(tapeData[124]), .Dout1(tapeData[125]));
  cvt_2x1_1x2 inst130 (.Din(inst64_dout), .Dout0(tapeData[126]), .Dout1(tapeData[127]));
endmodule
